# Altium schematic sheet peripherals.SchDoc
size Letter
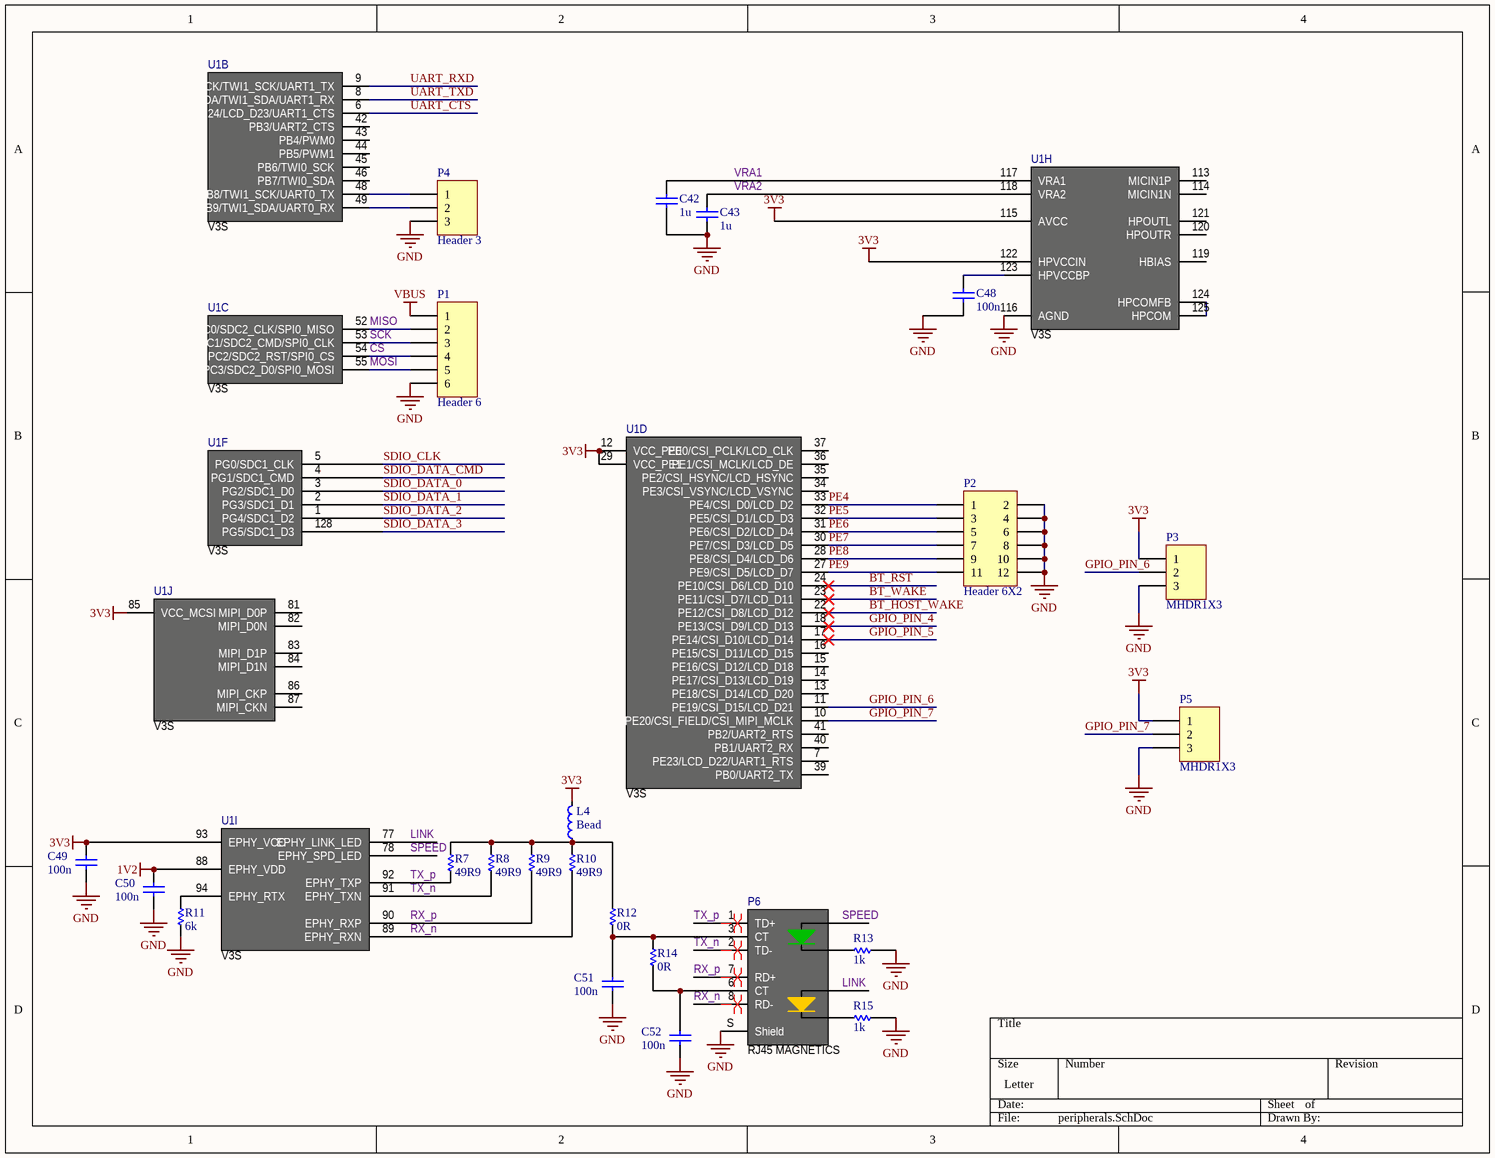
[diagram p0: peripherals.SchDoc]

## Parts
C42  1u  [CAPC1005N]
C43  1u  [CAPC1005N]
C48  100n  [CAPC1005N]
C49  100n  [CAPC1005N]
C50  100n  [CAPC1005N]
C51  100n  [CAPC1005N]
C52  100n  [CAPC1005N]
L4  value Bead  [INDC1005N]  (hidden comment: Inductor)
P1  Header 6  [HDR1X6-PINS]
P2  Header 6X2  [HDR2X6]
P3  MHDR1X3  [HDR1X3]
P4  Header 3  [HDR1X3]
P5  MHDR1X3  [HDR1X3]
P6  RJ45 MAGNETICS  [ethernet-b]
R7  49R9  [RESC1005N]
R8  49R9  [RESC1005N]
R9  49R9  [RESC1005N]
R10  49R9  [RESC1005N]
R11  6k  [RESC1005N]
R12  0R  [RESC1005N]
R13  1k  [RESC1005N]
R14  0R  [RESC1005N]
R15  1k  [RESC1005N]
U1  V3S  [V3S]  (parts B,C,D,F,H,I,J of 10)

## Nets
1V2: C50.2 U1.88(EPHY_VDD)
3V3: C49.2 L4.2 P3.1 P5.1 U1.12(VCC_PE0) U1.29(VCC_PE1) U1.85(VCC_MCSI) U1.93(EPHY_VCC) U1.115(AVCC) U1.122(HPVCCIN)
GND: C42.1 C43.1 C48.1 C49.1 C50.1 C51.1 C52.1 P1.6 P2.2 P2.4 P2.6 P2.8 P2.10 P2.12 P3.3 P4.3 P5.3 P6.S(Shield) R11.1 R13.1 R15.1 U1.116(AGND)
VBUS: P1.1
BT_HOST_WAKE: U1.22(PE12/CSI_D8/LCD_D12)
BT_RST: U1.24(PE10/CSI_D6/LCD_D10)
BT_WAKE: U1.23(PE11/CSI_D7/LCD_D11)
CS: P1.4 U1.54(PC2/SDC2_RST/SPI0_CS)
GPIO_PIN_4: U1.18(PE13/CSI_D9/LCD_D13)
GPIO_PIN_5: U1.17(PE14/CSI_D10/LCD_D14)
GPIO_PIN_6: P3.2 U1.11(PE19/CSI_D15/LCD_D21)
GPIO_PIN_7: P5.2 U1.10(PE20/CSI_FIELD/CSI_MIPI_MCLK)
LINK: P6.11 U1.77(EPHY_LINK_LED)
MISO: P1.2 U1.52(PC0/SDC2_CLK/SPI0_MISO)
MOSI: P1.5 U1.55(PC3/SDC2_D0/SPI0_MOSI)
PE4: P2.1 U1.33(PE4/CSI_D0/LCD_D2)
PE5: P2.3 U1.32(PE5/CSI_D1/LCD_D3)
PE6: P2.5 U1.31(PE6/CSI_D2/LCD_D4)
PE7: P2.7 U1.30(PE7/CSI_D3/LCD_D5)
PE8: P2.9 U1.28(PE8/CSI_D4/LCD_D6)
PE9: P2.11 U1.27(PE9/CSI_D5/LCD_D7)
RX_n: P6.8(RD-) R10.2 U1.89(EPHY_RXN)
RX_p: P6.7(RD+) R9.2 U1.90(EPHY_RXP)
SCK: P1.3 U1.53(PC1/SDC2_CMD/SPI0_CLK)
SDIO_CLK: U1.5(PG0/SDC1_CLK)
SDIO_DATA_0: U1.3(PG2/SDC1_D0)
SDIO_DATA_1: U1.2(PG3/SDC1_D1)
SDIO_DATA_2: U1.1(PG4/SDC1_D2)
SDIO_DATA_3: U1.128(PG5/SDC1_D3)
SDIO_DATA_CMD: U1.4(PG1/SDC1_CMD)
SPEED: P6.9 U1.78(EPHY_SPD_LED)
TX_n: P6.2(TD-) R8.2 U1.91(EPHY_TXN)
TX_p: P6.1(TD+) R7.2 U1.92(EPHY_TXP)
UART_CTS: U1.6(PE24/LCD_D23/UART1_CTS)
UART_RXD: U1.9(PE21/CSI_SCK/TWI1_SCK/UART1_TX)
UART_TXD: U1.8(PE22/CSI_SDA/TWI1_SDA/UART1_RX)
VRA1: C42.2 U1.117(VRA1)
VRA2: C43.2 U1.118(VRA2)
NetC48_2: C48.2 U1.123(HPVCCBP)
NetC51_2: C51.2 P6.3(CT) R12.1 R14.2
NetC52_2: C52.2 P6.6(CT) R14.1
NetL4_1: L4.1 R7.1 R8.1 R9.1 R10.1 R12.2
NetP4_1: P4.1 U1.48(PB8/TWI1_SCK/UART0_TX)
NetP4_2: P4.2 U1.49(PB9/TWI1_SDA/UART0_RX)
NetP6_10: P6.10 R13.2
NetP6_12: P6.12 R15.2
NetR11_2: R11.2 U1.94(EPHY_RTX)
NetU1_124: U1.124(HPCOMFB) U1.125(HPCOM)

Not connected (* = marked no-connect by the designer): U1 7(PE23/LCD_D22/UART1_RTS) 13(PE18/CSI_D14/LCD_D20) 14(PE17/CSI_D13/LCD_D19) 15(PE16/CSI_D12/LCD_D18) 16(PE15/CSI_D11/LCD_D15) 34(PE3/CSI_VSYNC/LCD_VSYNC) 35(PE2/CSI_HSYNC/LCD_HSYNC) 36(PE1/CSI_MCLK/LCD_DE) 37(PE0/CSI_PCLK/LCD_CLK) 39(PB0/UART2_TX) 40(PB1/UART2_RX) 41(PB2/UART2_RTS) 42(PB3/UART2_CTS) 43(PB4/PWM0) 44(PB5/PWM1) 45(PB6/TWI0_SCK) 46(PB7/TWI0_SDA) 81(MIPI_D0P) 82(MIPI_D0N) 83(MIPI_D1P) 84(MIPI_D1N) 86(MIPI_CKP) 87(MIPI_CKN) 113(MICIN1P) 114(MICIN1N) 119(HBIAS) 120(HPOUTR) 121(HPOUTL)

## Layout directives
differential pair: RX_n, RX_p, TX_n, TX_p

## Library data of the parts
C42 C43 C48-C52 = Cap Semi: Capacitor (Semiconductor SIM Model); Published: 8-Jun-2000; LatestRevisionDate: 29-May-2009; LatestRevisionNote: IPC-7351 Footprint Added.; PackageReference: C1206; Publisher: Altium Limited; PackageDescription: Chip Capacitor
L4 = Inductor: Code_IEC: 1005; Published: 8-Jun-2000; LatestRevisionDate: 29-May-2009; LatestRevisionNote: IPC-7351 Footprint Added.; PackageReference: 0402-A; Publisher: Altium Limited; PackageDescription: Chip Inductor; Code_JEITA: 0402
P1 = Header 6: Header, 6-Pin; LatestRevisionDate: 17-Jul-2002; LatestRevisionNote: Re-released for DXP Platform.; Publisher: Altium Limited
P2 = Header 6X2: Header, 6-Pin, Dual row; LatestRevisionDate: 17-Jul-2002; LatestRevisionNote: Re-released for DXP Platform.; Publisher: Altium Limited
P3 P5 = MHDR1X3: Header, 3-Pin; LatestRevisionDate: 17-Jul-2002; LatestRevisionNote: Re-released for DXP Platform.; Publisher: Altium Limited
P4 = Header 3: Header, 3-Pin; LatestRevisionDate: 17-Jul-2002; LatestRevisionNote: Re-released for DXP Platform.; Publisher: Altium Limited
P6 = Ethernet-B: RJ-45 Connector with 10/100 Base-TX Magnetics
R7-R15 = Res Semi: Semiconductor Resistor; Published: 8-Jun-2000; LatestRevisionDate: 17-Jul-2002; LatestRevisionNote: Re-released for DXP Platform.; PackageReference: AXIAL-0.5; Publisher: Altium Limited; PackageDescription: Axial Device, Thru-Hole; 2 Leads; 0.5 in Pin Spacing